# EasyEDA Pro project 主板-智能视觉.epro

# Schematic Schematic1
Board Name: Board1; Create Date: 2026-01-07; Page Name: P1; Project Name: 主板-智能视觉; Schematic Name: Schematic1; Update Date: 2026-01-07; Company: 嘉立创EDA; Page Size: A4; Version: V1.0
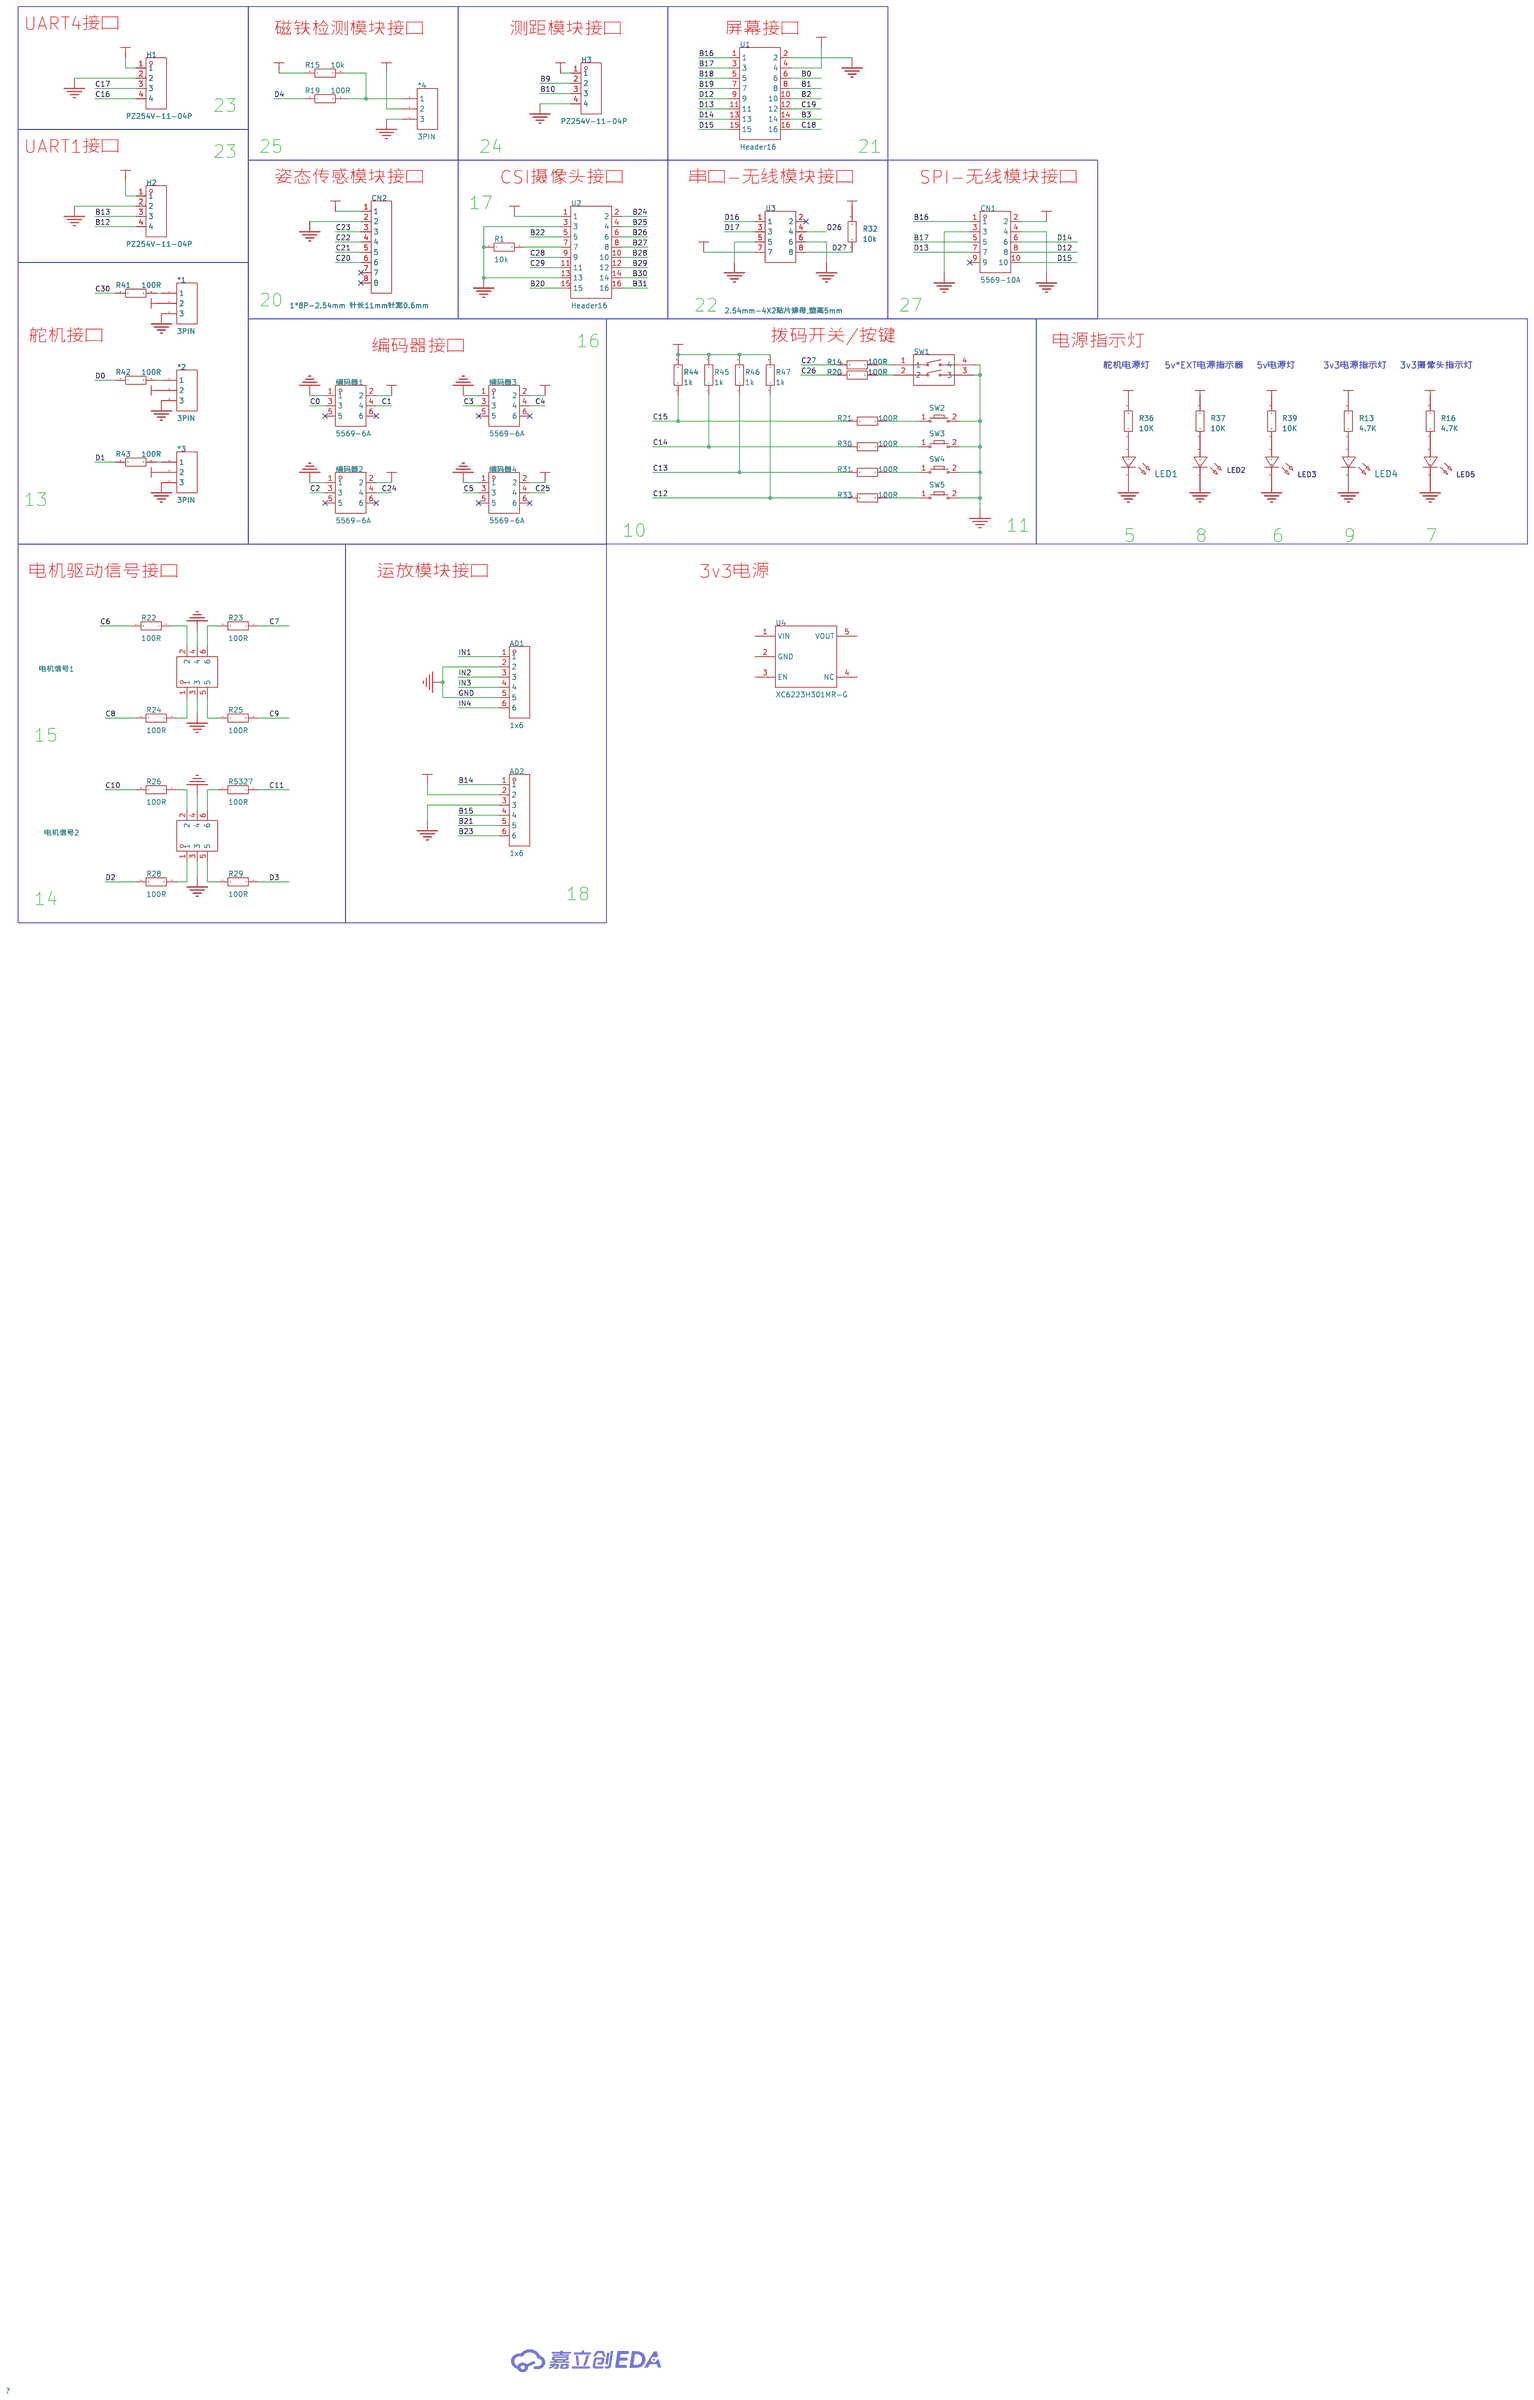
[diagram p0: schematic sheet]

## Parts
*1  3PIN  [3PIN]
*2  3PIN  [3PIN]
*3  3PIN  [3PIN]
*4  3PIN  [3PIN]
AD1  1x6  [HDR-TH_6P-P2.54-V-F]
AD2  1x6  [HDR-TH_6P-P2.54-V-F]
CN1  5569-10A  [CONN-TH_10P-P4.20_5569-10A]
CN2  1*8P-2.54mm 针长11mm针宽0.6mm  [HDR-TH_8P-P2.54-V-F-S2.54]
H1  PZ254V-11-04P  [HDR-TH_4P-P2.54-V-M]
H2  PZ254V-11-04P  [HDR-TH_4P-P2.54-V-M]
H3  PZ254V-11-04P  [HDR-TH_4P-P2.54-V-M]
LED1  -  [LED_0603]
LED2  -  [LED_0603]
LED3  -  [LED_0603]
LED4  -  [LED_0603]
LED5  -  [LED_0603]
R1  10k  [R0603]
R13  4.7K  [R0603]
R14  100Ω ±1% 62.5mW  [R0402]
R15  10k  [R0603]
R16  4.7K  [R0603]
R19  100Ω ±1% 62.5mW  [R0402]
R20  100Ω ±1% 62.5mW  [R0402]
R21  100Ω ±1% 62.5mW  [R0402]
R22  100Ω ±1% 62.5mW  [R0402]
R23  100Ω ±1% 62.5mW  [R0402]
R24  100Ω ±1% 62.5mW  [R0402]
R25  100Ω ±1% 62.5mW  [R0402]
R26  100Ω ±1% 62.5mW  [R0402]
R28  100Ω ±1% 62.5mW  [R0402]
R29  100Ω ±1% 62.5mW  [R0402]
R30  100Ω ±1% 62.5mW  [R0402]
R31  100Ω ±1% 62.5mW  [R0402]
R32  10k  [R0603]
R33  100Ω ±1% 62.5mW  [R0402]
R36  10K  [R0603]
R37  10K  [R0603]
R39  10K  [R0603]
R41  100Ω ±1% 62.5mW  [R0402]
R42  100Ω ±1% 62.5mW  [R0402]
R43  100Ω ±1% 62.5mW  [R0402]
R44  1k  [R0603]
R45  1k  [R0603]
R46  1k  [R0603]
R47  1k  [R0603]
R5327  100Ω ±1% 62.5mW  [R0402]
SW1  CES-0202MC  [SW-TH_NIDEC_CES-0202MC]
SW2  -  [Key_SMD_3x4x2]
SW3  -  [Key_SMD_3x4x2]
SW4  -  [Key_SMD_3x4x2]
SW5  -  [Key_SMD_3x4x2]
U1  Header16  [CONN-TH_16P-P2.50_C9900044747]
U2  Header16  [CONN-TH_16P-P2.50_C9900044747]
U3  2.54mm-4X2贴片排母,塑高5mm  [HDR-SMD_8P-P2.54-V-F-R2-C4-S7.1]
U4  XC6223H301MR-G
电机信号1  5569-6A  [CONN-TH_6P-P4.20_5569-6A-1]
电机信号2  5569-6A  [CONN-TH_6P-P4.20_5569-6A-1]
编码器1  5569-6A  [CONN-TH_6P-P4.20_5569-6A-1]
编码器2  5569-6A  [CONN-TH_6P-P4.20_5569-6A-1]
编码器3  5569-6A  [CONN-TH_6P-P4.20_5569-6A-1]
编码器4  5569-6A  [CONN-TH_6P-P4.20_5569-6A-1]

## Library data of the parts
*1-*4 = 3PIN: Origin Footprint 2: 1*3PIN; Origin Footprint 4: 1*3PIN; Origin Footprint 5: 1*3PIN
AD1 AD2 = 1x6: Supplier: LCSC; Manufacturer: BOOMELE; Manufacturer Part: Female header 1*6p; Supplier Part: C40877; JLCPCB Part Class: Extended Part
CN1 = 5569-10A: Supplier Part: C9900070524; Supplier Footprint: 2*5p; JLCPCB Part Class: Extended Part; Supplier: LCSC
CN2 = 1*8P-2.54mm 针长11mm针宽0.6mm: Supplier Part: C9900024110; Supplier Footprint: 1*8P-2.54mm; JLCPCB Part Class: 扩展库; Supplier: LCSC
H1-H3 = PZ254V-11-04P: 插针结构:1x4P;间距:2.54mm;行距:-;圆针/方针:方针;安装方式:直插;排数:单排;总PIN位数:4P;额定电流:3A;额定电压:250V;配合针长度:6mm;塑高:2.5mm;端接针长度:3mm;触头材质:-;工作温度:-40℃~+105℃;颜色:黑色;; LCSC Part Name: 1x4P 间距:2.54mm 方针 直插; Supplier Part: C2691448; Manufacturer: XFCN(兴飞); Supplier Footprint: 插件,P=2.54mm; JLCPCB Part Class: 扩展库; Datasheet: https://item.szlcsc.com/datasheet/PZ254V-11-04P/2801085.html; Supplier: LCSC; Pin Structure: 1x4P; Pitch: 2.54mm; Circluar Pins/Square Pins: 方针; Mounting Type: 直插; Number of Rows: 单排; Number of Pins: 4P; Current Rating: 3A; Voltage Rating (Max): 250V; Length of Mating Pin: 6mm; Insulation Height: 2.5mm; Length of End Connection Pin: 3mm; Operating Temperature: -40℃~+105℃; Color: 黑色
LED1 LED4 = LED_0603-R: Supplier Footprint: 0603
LED2 LED5 = LED_0603-G: Supplier Footprint: 0603
LED3 = LED_0603-B: Supplier Footprint: 0603
R1 R15 R32 R44-R47 = R-10K-1%: 电阻类型:厚膜电阻;阻值:10kΩ;精度:±1%;功率:100mW;工作电压:75V;温度系数:±100ppm/℃;; Manufacturer: UNI-ROYAL(厚声); Manufacturer Part: 0603WAF1002T5E; Supplier: LCSC; Supplier Part: C25804; LCSC Part Name: 厚膜电阻 10kΩ ±1% 100mW; Supplier Footprint: 0603; JLCPCB Part Class: Basic Part; Datasheet: https://atta.szlcsc.com/upload/public/pdf/source/20200306/C422600_1E6D84923E4A46A82E41ADD87F860B5C.pdf; Type: 厚膜电阻; Tolerance: ±1%; Power(Watts): 100mW; Voltage-Supply(Max): 75V; Temperature Coefficient: ±100ppm/℃; Operating Temperature: -55℃~+155℃
R13 R16 R36 R37 R39 = Res_0603: Supplier Footprint: 0603
R14 R19-R26 R28-R31 R33 R41-R43 R5327 = 100Ω ±1% 62.5mW R0402: LCSC Part Name: 100Ω(1000) ±1% 编带; Supplier Part: C25076; Manufacturer: UNI-ROYAL(厚声); Manufacturer Part: 0402WGF1000TCE; Supplier Footprint: 0402; JLCPCB Part Class: Basic Part; Datasheet: https://atta.szlcsc.com/upload/public/pdf/source/20170920/C25076_1505901197574982707.pdf; Supplier: LCSC; ERP编码: 000
SW1 = CES-0202MC: 特性：双镀金触点,接触稳定性极佳。符合RoHS标准。触感清脆。应用：热水设备。空调设备; LCSC Part Name: 拨码开关 (间距2.54mm); Supplier Part: C2921546; Manufacturer: NIDEC(尼得科); Supplier Footprint: 插件,P=2.54mm; JLCPCB Part Class: 扩展库; Datasheet: https://item.szlcsc.com/datasheet/CES-0202MC/3230398.html; Supplier: LCSC
SW2-SW5 = Key_SMD_3x4x2: Supplier Footprint: SMD
U1 U2 = Header16_C9900044747: Supplier Part: C9900044747; Supplier Footprint: TH-2*8P-2.54; JLCPCB Part Class: 扩展库; Supplier: LCSC
U3 = 2.54mm-4X2贴片排母,塑高5mm: Supplier Part: C9900015268; Supplier Footprint: BDM_SMD2.54-2*4; JLCPCB Part Class: 扩展库; Supplier: LCSC
U4 = RT9013: 存货编码: 1110404156; 存货名称: 集成电路
电机信号1 电机信号2 编码器1-编码器4 = 5569-6A: Supplier Part: C9900070523; Supplier Footprint: 2*3p; JLCPCB Part Class: Extended Part; Supplier: LCSC

## Nets
3V3: *4.2 AD2.2 CN2.1 H3.1 R13.2 R15.1 R32.2 R44.2 R45.2 R46.2 R47.2 U1.4 编码器1.2 编码器2.2 编码器3.2 编码器4.2
GND: *1.3 *2.3 *3.3 *4.3 AD1.2 AD1.5 AD2.3 CN1.3 CN1.4 CN2.2 H1.2 H2.2 H3.4 LED1.1(C) LED2.1(C) LED3.1(C) LED4.1(C) LED5.1(C) R1.1 SW1.3 SW1.4 SW2.2 SW3.2 SW4.2 SW5.2 U1.2 U2.3 U2.13 U3.5 U3.6 电机信号1.3 电机信号1.4 电机信号2.3 电机信号2.4 编码器1.1 编码器2.1 编码器3.1 编码器4.1
VCC-5V: R39.2
VCC-5V-EXT: CN1.2 H1.1 H2.1 R37.2 U3.7
VCC_SERVO: *1.2 *2.2 *3.2 R36.2
B0: U1.6
B1: U1.8
B2: U1.10
B3: U1.14
B9: H3.2
B10: H3.3
B12: H2.4
B13: H2.3
B14: AD2.1
B15: AD2.4
B16: CN1.1 U1.1
B17: CN1.5 U1.3
B18: U1.5
B19: U1.7
B20: U2.15
B21: AD2.5
B22: U2.5
B23: AD2.6
B24: U2.2
B25: U2.4
B26: U2.6
B27: U2.8
B28: U2.10
B29: U2.12
B30: U2.14
B31: U2.16
C0: 编码器1.3
C1: 编码器1.4
C2: 编码器2.3
C3: 编码器3.3
C4: 编码器3.4
C5: 编码器4.3
C6: R22.2
C7: R23.1
C8: R24.2
C9: R25.2
C10: R26.2
C11: R5327.1
C12: R33.2 R47.1
C13: R31.2 R46.1
C14: R30.2 R45.1
C15: R21.2 R44.1
C16: H1.4
C17: H1.3
C18: U1.16
C19: U1.12
C20: CN2.6
C21: CN2.5
C22: CN2.4
C23: CN2.3
C24: 编码器2.4
C25: 编码器4.4
C26: R20.2
C27: R14.2
C28: U2.9
C29: U2.11
C30: R41.1
CSI-3V3: R16.2 U2.1
D0: R42.1
D1: R43.1
D2: R28.2
D3: R29.2
D4: R19.1
D12: CN1.8 U1.9
D13: CN1.7 U1.11
D14: CN1.6 U1.13
D15: CN1.10 U1.15
D16: U3.1
D17: U3.3
D26: U3.4
D27: R32.1 U3.8
IN1: AD1.1
IN2: AD1.3
IN3: AD1.4
IN4: AD1.6
Net-(*1-1): *1.1 R41.2
Net-(*2-1): *2.1 R42.2
Net-(*3-1): *3.1 R43.2
Net-(*4-1): *4.1 R15.2 R19.2
Net-(LED1-2): LED1.2(A) R36.1
Net-(LED2-2): LED2.2(A) R37.1
Net-(LED3-2): LED3.2(A) R39.1
Net-(LED4-2): LED4.2(A) R13.1
Net-(LED5-2): LED5.2(A) R16.1
Net-(R1-2): R1.2 U2.7
Net-(R14-1): R14.1 SW1.1
Net-(R20-1): R20.1 SW1.2
Net-(R21-1): R21.1 SW2.1
Net-(R22-1): R22.1 电机信号1.2
Net-(R23-2): R23.2 电机信号1.6
Net-(R24-1): R24.1 电机信号1.1
Net-(R25-1): R25.1 电机信号1.5
Net-(R26-1): R26.1 电机信号2.2
Net-(R28-1): R28.1 电机信号2.1
Net-(R29-1): R29.1 电机信号2.5
Net-(R30-1): R30.1 SW3.1
Net-(R31-1): R31.1 SW4.1
Net-(R33-1): R33.1 SW5.1
Net-(R5327-2): R5327.2 电机信号2.6

Not connected (* = marked no-connect by the designer): CN1 9*; CN2 7* 8*; U3 2*; U4 1(VIN) 2(GND) 3(EN) 4(NC) 5(VOUT); 编码器1 5* 6*; 编码器2 5* 6*; 编码器3 5* 6*; 编码器4 5* 6*

## Notes on the sheet
- UART4接口
- 磁铁检测模块接口
- 测距模块接口
- 屏幕接口
- 23
- UART1接口
- 25
- 24
- 21
- 23
- 姿态传感模块接口
- CSI摄像头接口
- 串口-无线模块接口
- SPI-无线模块接口
- 17
- 20
- 22
- 27
- 舵机接口
- 16
- 拨码开关/按键
- 电源指示灯
- 编码器接口
- 舵机电源灯
- 5v*EXT电源指示器
- 5v电源灯
- 3v3电源指示灯
- 3v3摄像头指示灯
- 13
- 10
- 11
- 5
- 8
- 6
- 9
- 7
- 电机驱动信号接口
- 运放模块接口
- 3v3电源
- 15
- 18
- 14
